# Altium schematic sheet Block.Diagram.SchDoc: Wireles Securty Detector
size 420 x 297 mm; Date: 06.12.2023; CheckedBy: Arda B.; DrawnBy: Arda BOZKURT; DocumentNumber: 2; Revision: 001; SheetNumber: 2; SheetTotal: 5; ENG_APP_DATE: --/--/--; DSN_APP_DATE: --/--/--; CHK_APP_DATE: --/--/--; Size: A3; Department: HDD
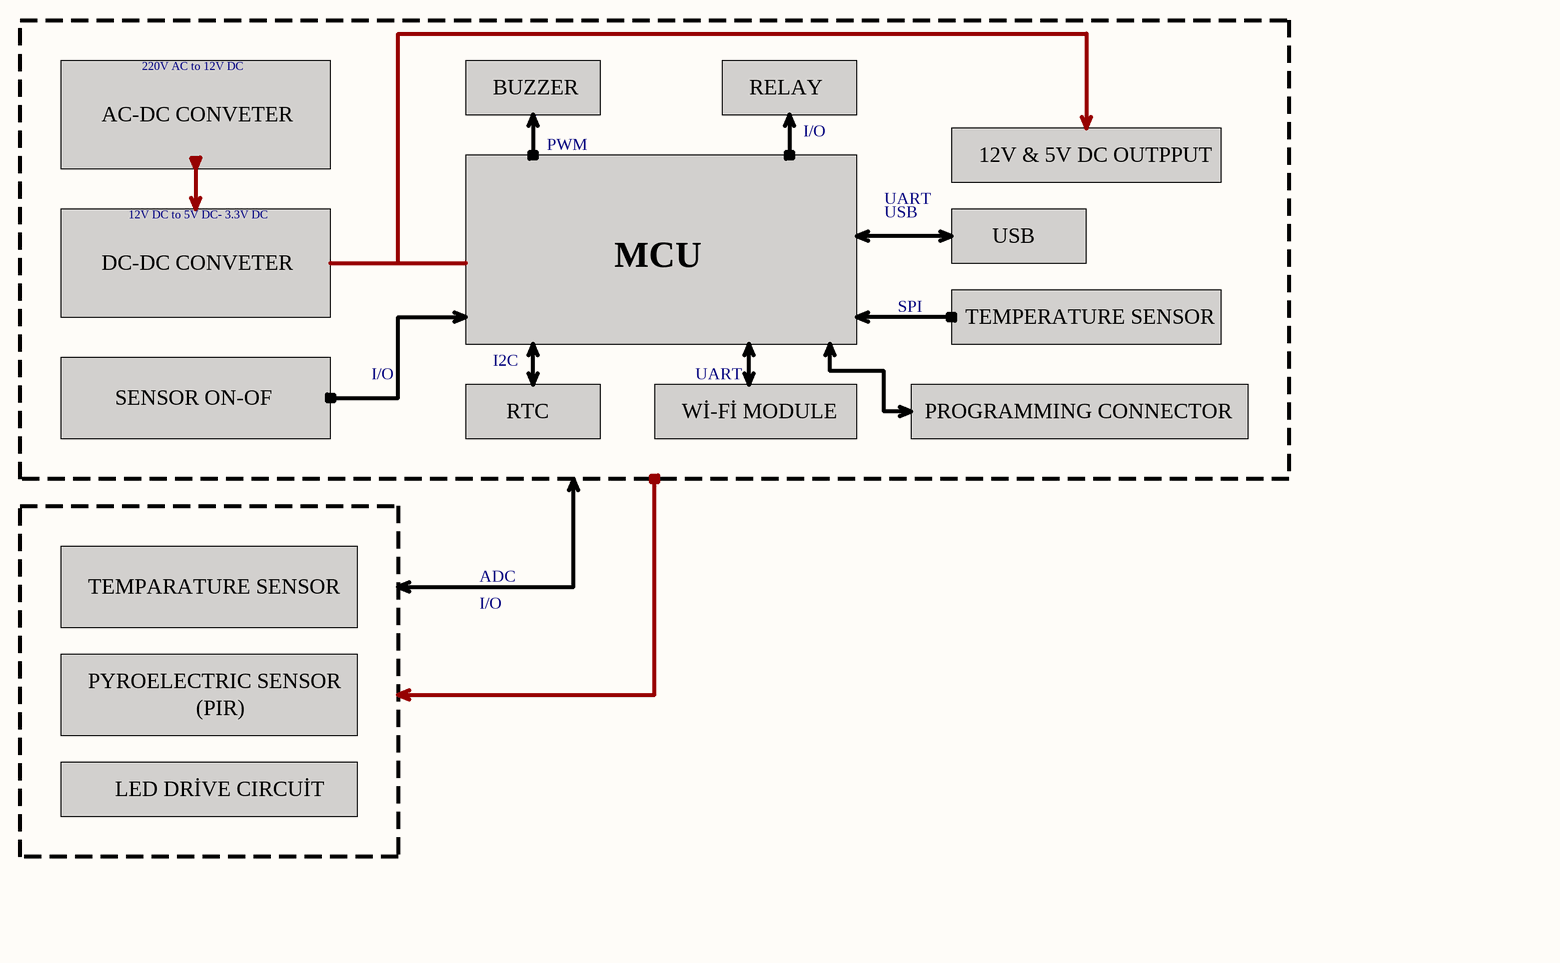
[diagram p0: Block.Diagram.SchDoc]

## Notes on the sheet
- 220V AC to 12V DC
- AC-DC CONVETER
- BUZZER
- RELAY
- I/O
- PWM
- UART
- 12V & 5V DC OUTPPUT
- DC-DC CONVETER
- 12V DC to 5V DC- 3.3V DC
- MCU
- USB
- SPI
- TEMPERATURE SENSOR
- SENSOR ON-OF
- I2C
- RTC
- Wİ-Fİ MODULE
- PROGRAMMING CONNECTOR
- TEMPARATURE SENSOR
- ADC
- HABERLEŞME PROTOKOLLERİ
  SENKRON VE ASENKRN
  UART
  USART
  I2C
  SPI
- PYROELECTRIC SENSOR
- (PIR)
- LED DRİVE CIRCUİT
- KOMPONENT:
  -RTC : M41T00
  -WİFİ MODULE : ESP32-WROOM32-E
  -PYRO SENSOR : LHI 878/3902
  -TEMPETURE OUTSİDE : +TFPT1206L1002FM
  -TEMTURE İNSİDE : MAX6662MSA+
  -MSU : STM32F103C6T6A
  -RELAY : ALQ112
  -BUZZER : CMI-9605IC-0580T
  -SENSOR ON/OF : EG1215AA
  -AC-DC CONVERTER :
  TRAFO: BV032S12010-ZU
  BRİDGE DİODE: DB105STR
  -DC-DC CONVERTER :
  5VDC: LM2675MX-12/NOBP
  3V3DC: AP7361-33E-13
  -LED DRİVER MOSFET : SSM3K357R,LF
- REVİSİON
- DESCRIPTION
- DATE
- APPROVED
- DWG NO:
- TAINIM/DESCRIPTION
- REV:
- DOSYA ADI/FİLE NAME
- HAZIRLAYAN/PREPARED BY
- KONTROL EDEN/ CHECKED BY
- YAYIN TARİHİ/REL. DATE
- DEĞ TARİHİ/CHANCE DATE
- ONAYLAYAN/APPROVED BY
- REVİZYON/REVISION
- Arda Bozkurt
- BÖLÜM/DEPARTMENT
- BOYUT/SİZE
- SAYFA/SHEET
- of